# EAGLE design HandHeld_O2_Analyzer (EAGLE 9.4.2)
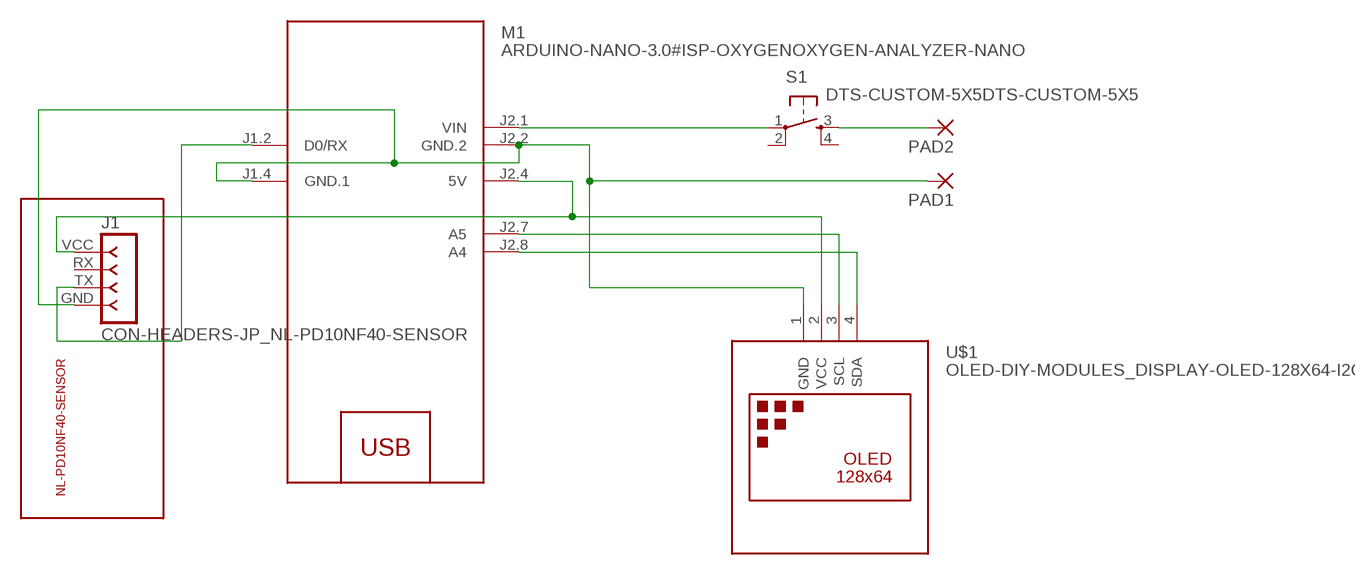
[diagram p0: schematic, sheet 1]

## Parts
J1  CON-HEADERS-JP_NL-PD10NF40-SENSOR  [CON-HEADERS-JP_NL-PD10NF40-SENSOR]
M1  ARDUINO-NANO-3.0#ISP-OXYGENOXYGEN-ANALYZER-NANO  [ARDUINO-NANO-3.0#ISP-OXYGEN]
PAD1  WIREPAD_2,54/0,8  [WIREPAD_2,54/0,8]
PAD2  WIREPAD_2,54/0,8  [WIREPAD_2,54/0,8]
S1  DTS-CUSTOM-5X5DTS-CUSTOM-5X5  [DTS-CUSTOM-5X5]
U$1  OLED-DIY-MODULES_DISPLAY-OLED-128X64-I2C  [OLED-DIY-MODULES_DISPLAY-OLED-128X64-I2C]

## Nets
N$1: M1.J2.8(A4) U$1.4(SDA)
N$2: M1.J2.7(A5) U$1.3(SCL)
N$3: J1.GND M1.J1.4(GND.1) M1.J2.2(GND.2) PAD1.1(P) U$1.1(GND)
N$4: J1.VCC M1.J2.4(5V) U$1.2(VCC)
N$5: M1.J2.1(VIN) S1.1
N$6: PAD2.1(P) S1.3
N$8: J1.TX M1.J1.2(D0/RX)
Unconnected: J1.RX S1.2 S1.4

## Library data of the parts
J1 = Oxygen Analyzer:CON-HEADERS-JP_NL-PD10NF40-SENSOR: FEMALE HEADER
M1 = GHIdiy-modules:ARDUINO-NANO-3.0#ISP-OXYGEN: Arduino Nano 3.0 (and compatible devices) with ISP pads More details available here: https://www.arduino.cc/en/Main/ArduinoBoardNano Click here to find device on ebay.com <http://www.ebay.com/sch/arduino+nano>
PAD1 PAD2 = Oxygen Analyzer:WIREPAD_2,54/0,8: THROUGH-HOLE PAD
S1 = switch-tact:DTS-CUSTOM-5X5
U$1 = Oxygen Analyzer:OLED-DIY-MODULES_DISPLAY-OLED-128X64-I2C: 128x64 Dot Matrix OLED Module based on SSD1306 chip Variant with I2C interface More details available here: http://www.instructables.com/id/Monochrome-096-i2c-OLED-display-with-arduino-SSD13/ SSD1306 datasheet: https://cdn-shop.adafruit.com/datasheets/SSD1306.pdf Click here to find device on ebay.com <http://www.ebay.com/sch/oled+display+128x64+iic> Note: There are two variants: I2C and SPI. Search for the proper version.

## Net classes
0 default: width 1.27 mm, drill 1.27 mm, clearance 0.889 mm
1 Profile1: width 0.762 mm, drill 0.762 mm, clearance 0.635 mm

## Board
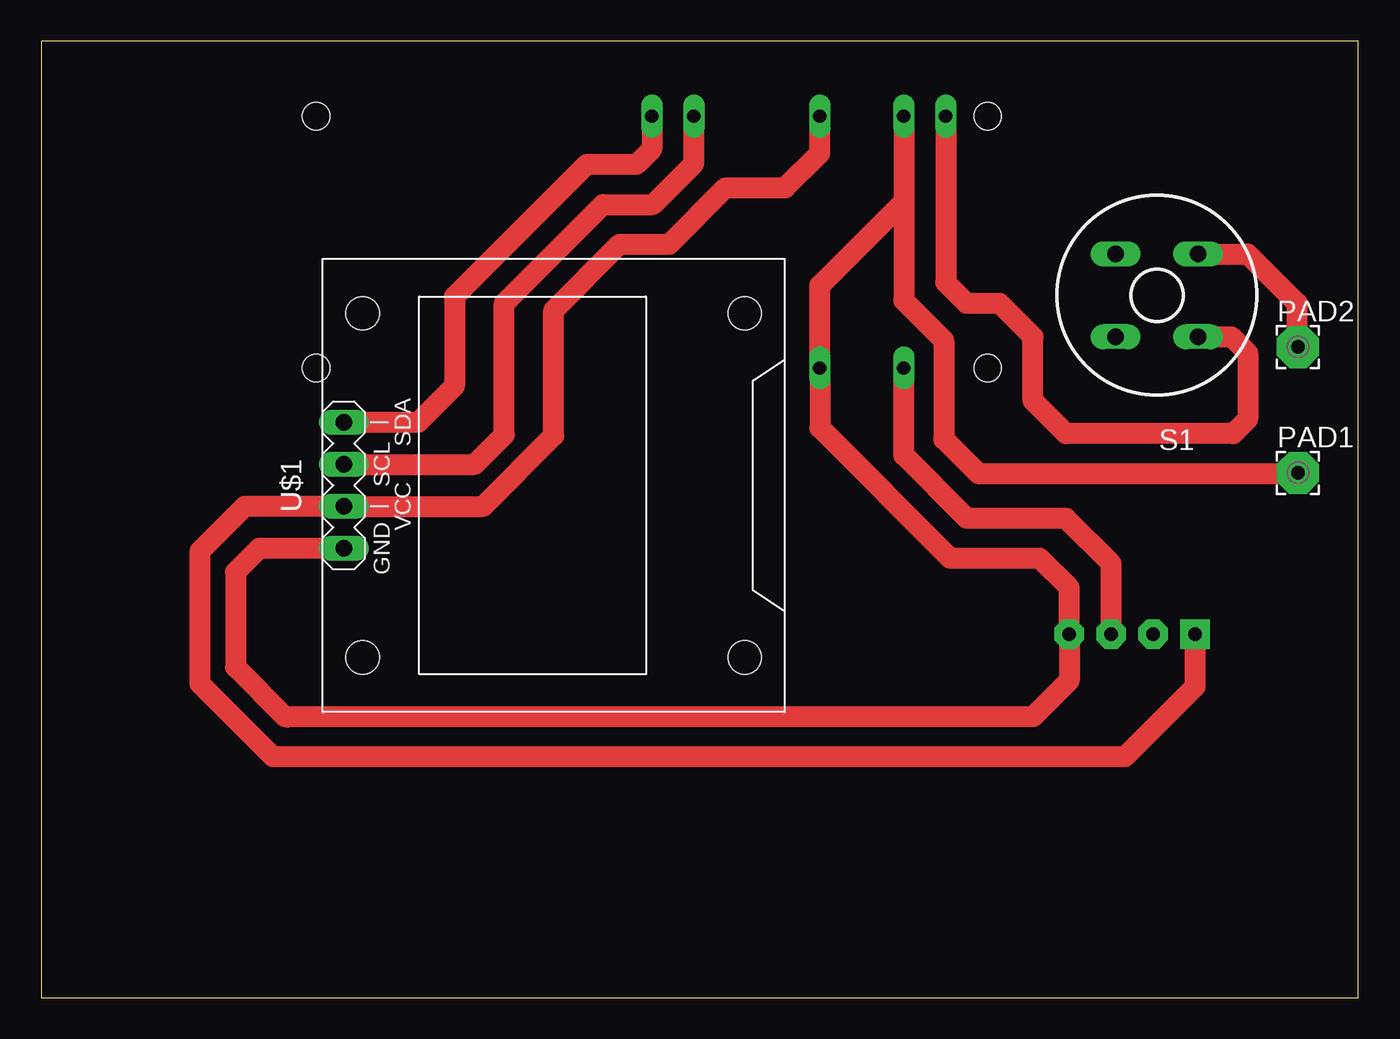
[diagram p1: board, top side]
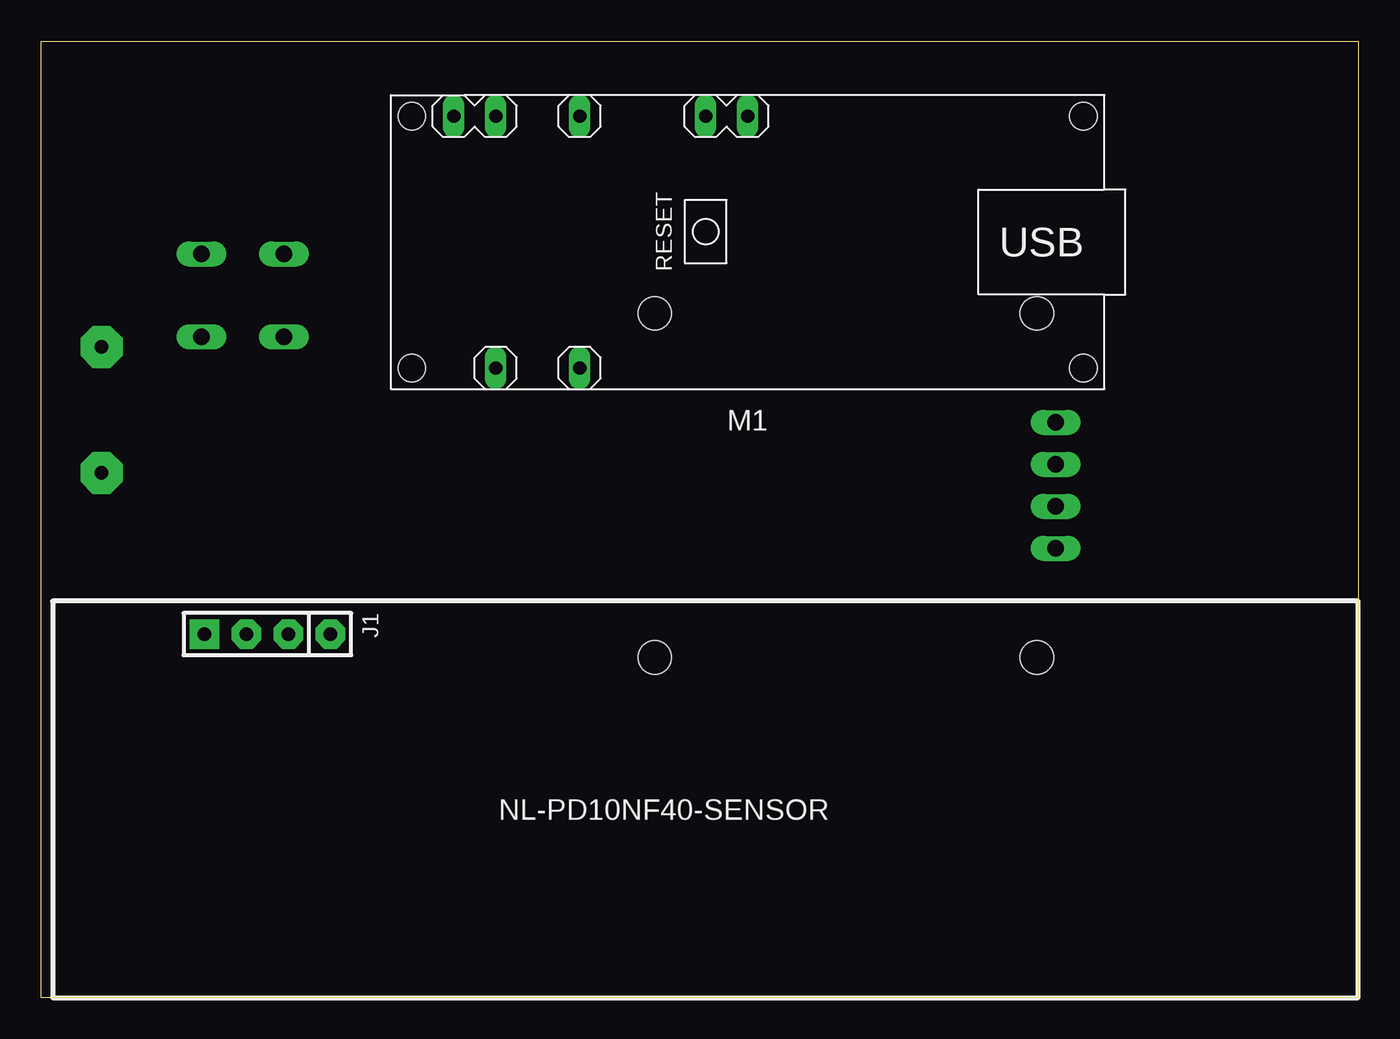
[diagram p2: board, bottom side, seen from below]

Size 79.68 x 57.87 mm. Coordinates in mm from the lower left corner, seen from the top.
Outline: 0,0 79.68,0 79.68,57.87 0,57.87 0,0
Copper layers (1*16): Top 0.035mm / dielectric 1.5mm / Bottom 0.035mm
Design rules "default": minimum track width 6mil, minimum drill 0.35mm, track to track 6mil, track to pad 6mil, pad to pad 6mil, via to via 6mil, smd to smd 6mil, copper to edge 40mil, drill to drill 6mil, minimum pad ring 10mil, minimum via ring 8mil, stop-mask expansion 4mil, vias tented up to drill 0mil, thermal gap 10mil

### Footprints (pad centres in the part's own frame; a part is rotated, then mirrored left to right if it is on the bottom)
CON-HEADERS-JP_NL-PD10NF40-SENSOR = drill 0.813 pad 1.778 octagon: GND 6.19,0; RX 11.27,0; TX 8.73,0 | drill 0.813 pad 1.778 square: VCC 13.81,0
ARDUINO-NANO-3.0#ISP-OXYGEN = drill 0.8 pad 1.016 long: J1.2 15.24,7.62; J1.4 10.16,7.62; J2.1 17.78,-7.62; J2.2 15.24,-7.62; J2.4 10.16,-7.62; J2.7 2.54,-7.62; J2.8 0,-7.62 | hole 1.651: -20.32,7.62; -20.32,-7.62; 20.32,-7.62; 20.32,7.62
WIREPAD_2,54/0,8 = drill 0.813 pad 2.54 octagon: 1 0,0
DTS-CUSTOM-5X5 = drill 1 long: 1 1,6; 2 6,6; 3 1,1; 4 6,1
OLED-DIY-MODULES_DISPLAY-OLED-128X64-I2C = drill 1 pad 1.27 long: 1 -3.81,12.7; 2 -1.27,12.7; 3 1.27,12.7; 4 3.81,12.7 | hole 2: -10.414,11.557; 10.414,11.557; 10.414,-11.557; -10.414,-11.557

### Placement (x,y rotation side)
J1  56,22 180 bottom
M1  36.94,45.72 180 bottom
PAD1  76.04,31.75 0 top
PAD2  76.04,39.37 0 top
S1  71,46 180 top
U$1  31,31 90 top

### Tracks (layer width: path | path; a pad name or v marks a point on that pad's centre or on a via)
N$1
  Top 1.27: M1.J2.8 36.94,51.35 36,50.41 33,50.41 25,42.41 25,37 22.81,34.81 U$1.4
N$2
  Top 1.27: M1.J2.7 39.48,50.48 37,48 34,48 28,42 28,34.05 26.22,32.27 U$1.3
N$3
  Top 1.27: M1.J2.2 52.18,48.18 | 52.18,48.18 52.18,42.19 54.61,39.76 54.61,33.8 56.71,31.71 76,31.71 PAD1.1 | 52.18,48.18 47.1,43.1 M1.J1.4 47.1,34.49 55,26.59 60.41,26.59 62.19,24.81 J1.GND 62.19,19.19 60,17 18,17 15,17 14.75,17 11.75,20 11.75,25.75 13.19,27.19 U$1.1
N$4
  Top 1.27: J1.VCC 69.81,18.81 65.59,14.59 14,14.59 9.59,19 9.59,27 12.32,29.73 U$1.2 26.73,29.73 31,34 31,41.59 35,45.59 38,45.59 41.41,49 45,49 47.1,51.1 M1.J2.4
N$5
  Top 1.27: M1.J2.1 54.72,43.28 56,42 58,42 60,40 60,36.12 62,34.12 72.12,34.12 73,35 72.99,35.01 72.99,39.01 72,40 S1.1
N$6
  Top 1.27: S1.3 73,45 76,42 76,39.41 PAD2.1
N$8
  Top 1.27: J1.TX 64.73,26.27 62,29 56,29 52.18,32.82 M1.J1.2